# Altium schematic sheet DCDCPowerConn.SchDoc
size A
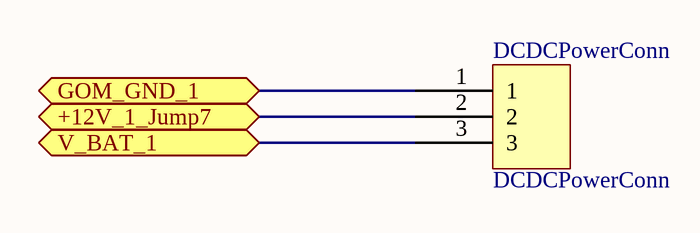
[diagram p0: DCDCPowerConn.SchDoc]

## Parts
DCDCPowerConn  DCDCPowerConn

## Ports
+12V_1_Jump7 (bidir), GOM_GND_1 (bidir), V_BAT_1 (bidir)

## Nets
+12V_1_Jump7: DCDCPowerConn.2 ; port +12V_1_Jump7
GOM_GND_1: DCDCPowerConn.1 ; port GOM_GND_1
V_BAT_1: DCDCPowerConn.3 ; port V_BAT_1